# EAGLE design gnax2 (EAGLE 7.3.0)

## Sheet 1 of 3
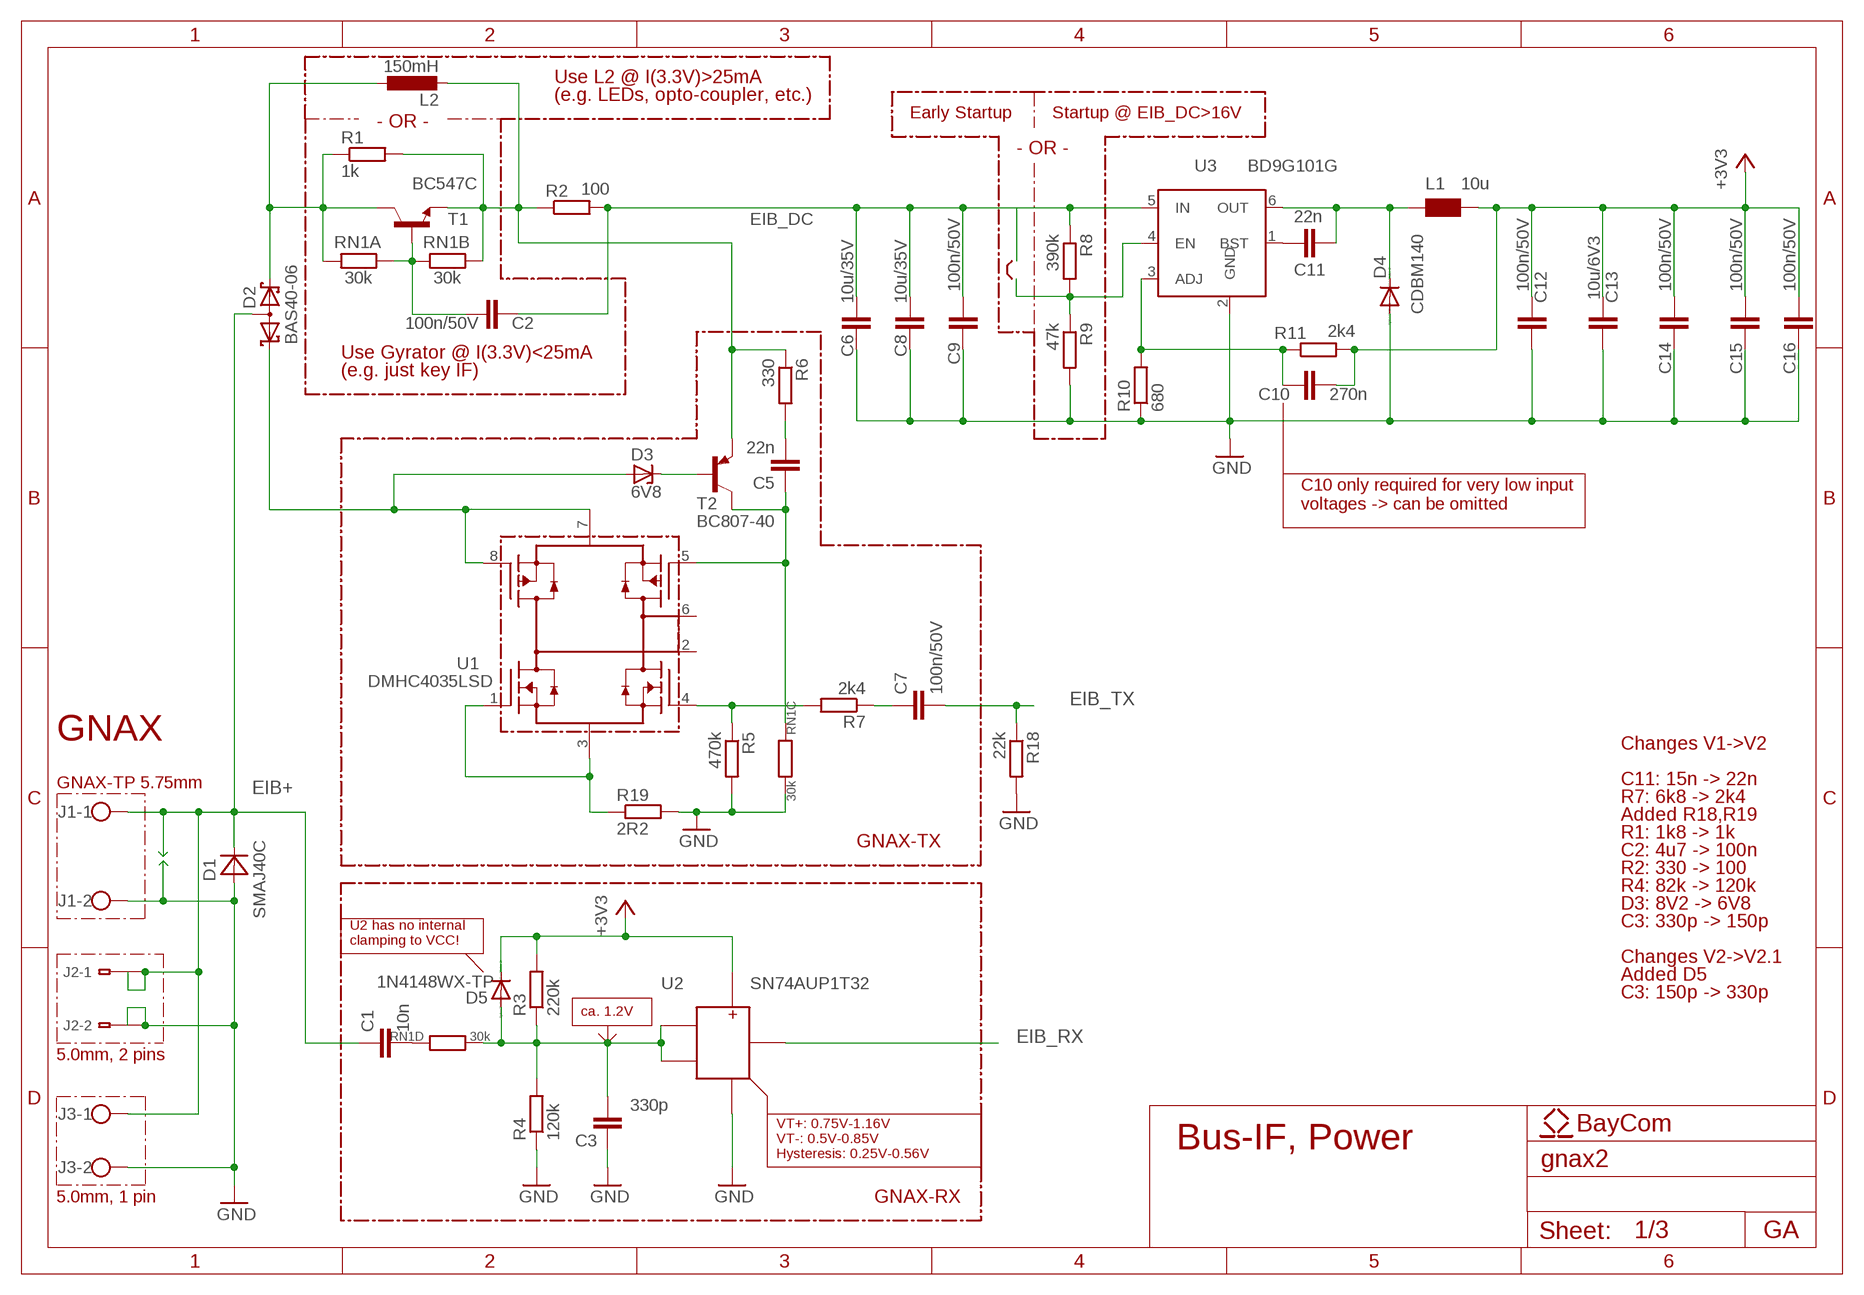
[diagram p0: schematic, sheet 1]

### Parts
C1  10n  C-EUC0603K  [C0603K]
C2  100n/50V  C-EUC0603K  [C0603K]
C3  330p  C-EUC0603K  [C0603K]
C5  22n  C-EUC0603K  [C0603K]
C6  10u/35V  C-EUC1206K  [C1206K]
C7  100n/50V  C-EUC0603K  [C0603K]
C8  10u/35V  C-EUC1206K  [C1206K]
C9  100n/50V  C-EUC0603K  [C0603K]
C10  270n  C-EUC0603K  [C0603K]
C11  22n  C-EUC0603K  [C0603K]
C12  100n/50V  C-EUC0603K  [C0603K]
C13  10u/6V3  C-EUC0603K  [C0603K]
C14  100n/50V  C-EUC0603K  [C0603K]
C15  100n/50V  C-EUC0603K  [C0603K]
C16  100n/50V  C-EUC0603K  [C0603K]
D1  SMAJ40C  MBRA340T3  [SMA]
D2  BAS40-06  [SOT23]
D3  6V8  ZENER-DIODESOT23  [SOT23]
D4  CDBM140  DIODE-SOD123  [SOD123]
D5  1N4148WX-TP  DIODE-SOD323-R  [SOD323-R]
J1  CON_2KNX  [KNX2]
J2-1  236-740-5,08  [236-4XX]
J2-2  236-740-5,08  [236-4XX]
J3  CON_2  [W237-102]
L1  10u  L_VARELL3  [L_ELL3]
L2  150mH  L-EU0204/5  [0204/5]
R1  1k  R-EU_R0603  [R0603]
R2  100  R-EU_R0603  [R0603]
R3  220k  R-EU_R0603  [R0603]
R4  120k  R-EU_R0603  [R0603]
R5  470k  R-EU_R0603  [R0603]
R6  330  R-EU_R0603  [R0603]
R7  2k4  R-EU_R0603  [R0603]
R8  390k  R-EU_R0603  [R0603]
R9  47k  R-EU_R0603  [R0603]
R10  680  R-EU_R0603  [R0603]
R11  2k4  R-EU_R0603  [R0603]
R18  22k  R-EU_R0603  [R0603]
R19  2R2  R-EU_R0805  [R0805]
RN1  30k  RNET12061  [1206_8]
T1  BC547C  BC847  [SOT23]
T2  BC807-40  BC807-40-PNP-SOT23-BEC  [SOT23-BEC]
U1  DMHC4035LSD  DHMC4035LSD  [SOP8]
U2  SN74AUP1T32  74AHC1G32SC88A  [SC88A]
U3  BD9G101G  BD9G101GSOT23-6  [SOT23-6]

### Nets
EIB+: C1.1 D1.C D2.3(AA) J1.1 J2-1.1@1(A1) J2-1.1@2(B1) J3.1 ; also sheet 3
EIB_DC: C2.1 C6.1 C8.1 C9.2 R2.2 R8.1 U3.5(IN) ; also sheet 3
EIB_RX: U2.4(Y) ; also sheet 2
EIB_TX: C7.2 R18.1 ; also sheet 2
FX: R19.1 U1.1(N1G) U1.3(N1S/N2S)
GND: C3.1 C6.2 C8.2 C9.1 C12.1 C13.1 C14.1 C15.1 C16.1 D1.A D4.A J1.2 J2-2.1@2(B1) J3.2 R4.1 R5.2 R9.2 R10.1 R18.2 R19.2 RN1.6 U2.3(GND) U3.2(GND) ; also sheet 2,3
LX: C11.1 D4.C L1.P$1 U3.6(OUT)
N$1: D2.1(K1) D3.1(A) U1.7(P1S/P2S) U1.8(P1G)
N$2: C1.2 RN1.4
N$6: R5.1 R7.2 U1.4(N2G)
N$7: C7.1 R7.1
N$8: D2.2(K2) L2.1 R1.1 RN1.1 T1.3(C)
N$12: C5.1 RN1.3 T2.C U1.5(P2G)
N$14: C3.2 D5.A R3.1 R4.2 RN1.5 U2.1(A) U2.2(B)
N$15: C5.2 R6.2
N$19: C11.2 U3.1(BST)
N$20: R8.2 R9.1 U3.4(EN)
N$24: C10.1 R10.2 R11.1 U3.3(ADJ)
N$28: C2.2 RN1.7 RN1.8 T1.1(B)
N$39: D3.3(C) T2.B
N$46: L2.2 R1.2 R2.1 R6.1 RN1.2 T1.2(E) T2.E
VCC: C10.2 C12.2 C13.2 C14.2 C15.2 C16.2 D5.C L1.P$2 R3.2 R11.2 U2.5(VCC) ; supply symbol labelled +3V3 ; also sheet 2,3
Unconnected: J2-2.1@1(A1) U1.2(P1D/N1D) U1.6(P2D/N2D)

### Notes on the sheet
- Use L2 @ I(3.3V)>25mA
- (e.g. LEDs, opto-coupler, etc.)
- Early Startup | Startup @ EIB_DC>16V
- - OR -
- - OR -
- Use Gyrator @ I(3.3V)<25mA
- (e.g. just key IF)
- C10 only required for very low input
  voltages -> can be omitted
- GNAX
- Changes V1->V2
- GNAX-TP 5.75mm
- C11: 15n -> 22n
- R7: 6k8 -> 2k4
- Added R18,R19
- R1: 1k8 -> 1k
- GNAX-TX
- C2: 4u7 -> 100n
- R2: 330 -> 100
- R4: 82k -> 120k
- D3: 8V2 -> 6V8
- C3: 330p -> 150p
- U2 has no internal 
  clamping to VCC!
- Changes V2->V2.1
- Added D5
- C3: 150p -> 330p
- ca. 1.2V
- 5.0mm, 2 pins
- Bus-IF, Power
- VT+: 0.75V-1.16V
  VT-: 0.5V-0.85V
  Hysteresis: 0.25V-0.56V
- 5.0mm, 1 pin | GNAX-RX
- GA

## Sheet 2 of 3
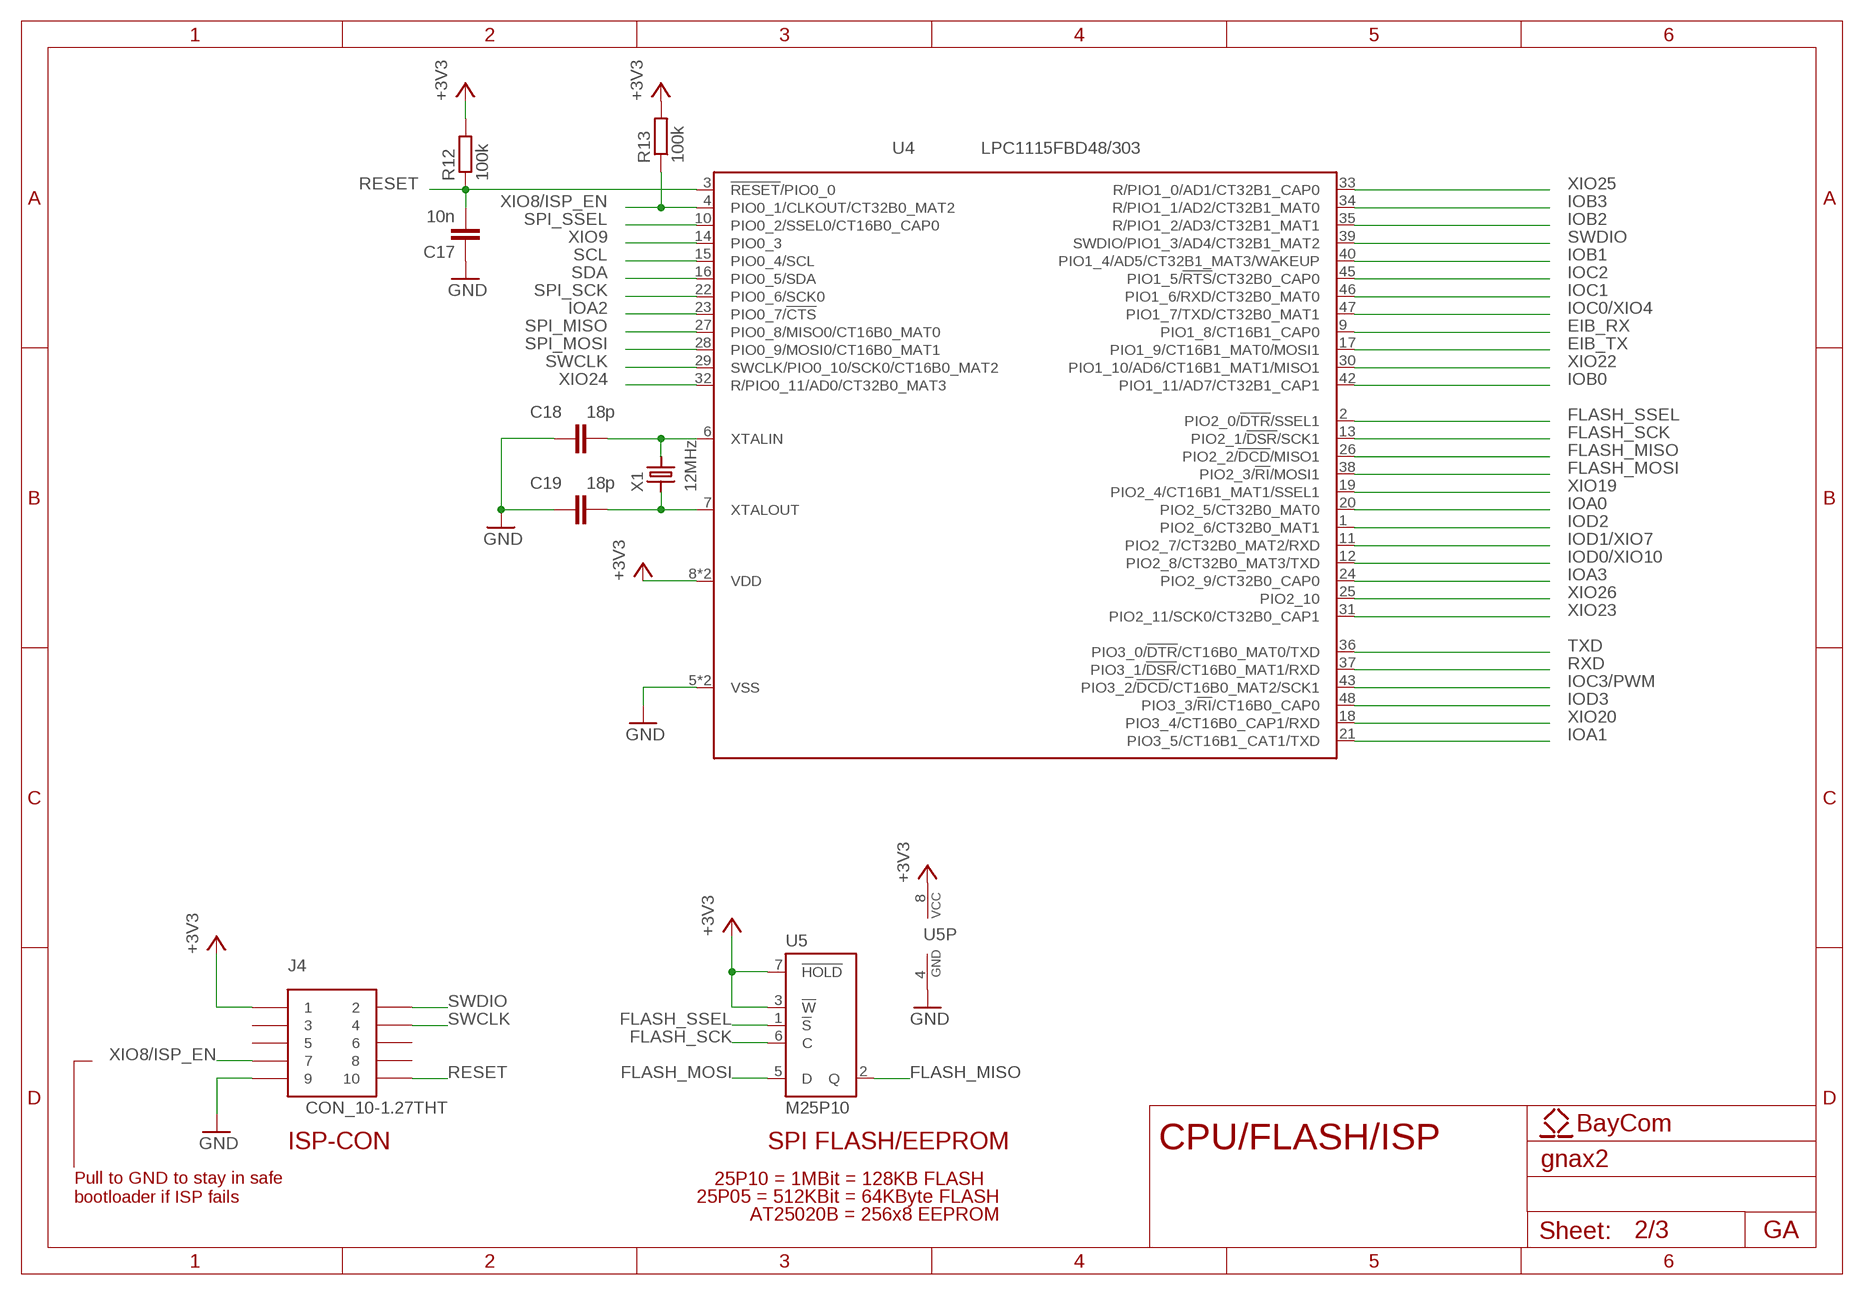
[diagram p1: schematic, sheet 2]

### Parts
C17  10n  C-EUC0603K  [C0603K]
C18  18p  C-EUC0603K  [C0603K]
C19  18p  C-EUC0603K  [C0603K]
J4  CON_10-1.27THT  [CON2X5_127-THT]
R12  100k  R-EU_R0603  [R0603]
R13  100k  R-EU_R0603  [R0603]
U4  LPC1115FBD48/303  [SOT313-2]
U5  M25P10  ST95P08M  [SO08]
X1  12MHz  XTAL5X3.2  [XTAL_5X3.2]

### Nets
EIB_RX: U4.9(PIO1_8/CT16B1_CAP0) ; also sheet 1
EIB_TX: U4.17(PIO1_9/CT16B1_MAT0/MOSI1) ; also sheet 1
FLASH_MISO: U4.26(PIO2_2/!DCD!/MISO1) U5.2(Q)
FLASH_MOSI: U4.38(PIO2_3/!RI!/MOSI1) U5.5(D)
FLASH_SCK: U4.13(PIO2_1/!DSR!/SCK1) U5.6(C)
FLASH_SSEL: U4.2(PIO2_0/!DTR!/SSEL1) U5.1(!S)
GND: C17.1 C18.1 C19.1 J4.9 U4.5(VSS) U4.41(VSS) U5.4(GND) ; also sheet 1,3
IOA0: U4.20(PIO2_5/CT32B0_MAT0) ; also sheet 3
IOA1: U4.21(PIO3_5/CT16B1_CAT1/TXD) ; also sheet 3
IOA2: U4.23(PIO0_7/!CTS!) ; also sheet 3
IOA3: U4.24(PIO2_9/CT32B0_CAP0) ; also sheet 3
IOB0: U4.42(PIO1_11/AD7/CT32B1_CAP1) ; also sheet 3
IOB1: U4.40(PIO1_4/AD5/CT32B1_MAT3/WAKEUP) ; also sheet 3
IOB2: U4.35(R/PIO1_2/AD3/CT32B1_MAT1) ; also sheet 3
IOB3: U4.34(R/PIO1_1/AD2/CT32B1_MAT0) ; also sheet 3
IOC0/XIO4: U4.47(PIO1_7/TXD/CT32B0_MAT1) ; also sheet 3
IOC1: U4.46(PIO1_6/RXD/CT32B0_MAT0) ; also sheet 3
IOC2: U4.45(PIO1_5/!RTS!/CT32B0_CAP0) ; also sheet 3
IOC3/PWM: U4.43(PIO3_2/!DCD!/CT16B0_MAT2/SCK1) ; also sheet 3
IOD0/XIO10: U4.12(PIO2_8/CT32B0_MAT3/TXD) ; also sheet 3
IOD1/XIO7: U4.11(PIO2_7/CT32B0_MAT2/RXD) ; also sheet 3
IOD2: U4.1(PIO2_6/CT32B0_MAT1) ; also sheet 3
IOD3: U4.48(PIO3_3/!RI!/CT16B0_CAP0) ; also sheet 3
N$3: C19.2 U4.7(XTALOUT) X1.1
N$4: C18.2 U4.6(XTALIN) X1.2
RESET: C17.2 J4.10 R12.1 U4.3(!RESET!/PIO0_0)
RXD: U4.37(PIO3_1/!DSR!/CT16B0_MAT1/RXD) ; also sheet 3
SCL: U4.15(PIO0_4/SCL) ; also sheet 3
SDA: U4.16(PIO0_5/SDA) ; also sheet 3
SPI_MISO: U4.27(PIO0_8/MISO0/CT16B0_MAT0) ; also sheet 3
SPI_MOSI: U4.28(PIO0_9/MOSI0/CT16B0_MAT1) ; also sheet 3
SPI_SCK: U4.22(PIO0_6/SCK0) ; also sheet 3
SPI_SSEL: U4.10(PIO0_2/SSEL0/CT16B0_CAP0) ; also sheet 3
SWCLK: J4.4 U4.29(SWCLK/PIO0_10/SCK0/CT16B0_MAT2)
SWDIO: J4.2 U4.39(SWDIO/PIO1_3/AD4/CT32B1_MAT2)
TXD: U4.36(PIO3_0/!DTR!/CT16B0_MAT0/TXD) ; also sheet 3
VCC: J4.1 R12.2 R13.2 U4.8(VDD) U4.44(VDD) U5.3(!W) U5.7(!HOLD) U5.8(VCC) ; supply symbol labelled +3V3 ; also sheet 1,3
XIO8/ISP_EN: J4.7 R13.1 U4.4(PIO0_1/CLKOUT/CT32B0_MAT2) ; also sheet 3
XIO9: U4.14(PIO0_3) ; also sheet 3
XIO19: U4.19(PIO2_4/CT16B1_MAT1/SSEL1) ; also sheet 3
XIO20: U4.18(PIO3_4/CT16B0_CAP1/RXD) ; also sheet 3
XIO22: U4.30(PIO1_10/AD6/CT16B1_MAT1/MISO1) ; also sheet 3
XIO23: U4.31(PIO2_11/SCK0/CT32B0_CAP1) ; also sheet 3
XIO24: U4.32(R/PIO0_11/AD0/CT32B0_MAT3) ; also sheet 3
XIO25: U4.33(R/PIO1_0/AD1/CT32B1_CAP0) ; also sheet 3
XIO26: U4.25(PIO2_10) ; also sheet 3
Unconnected: J4.3 J4.5 J4.6 J4.8

### Notes on the sheet
- ISP-CON | SPI FLASH/EEPROM | CPU/FLASH/ISP
- 25P10 = 1MBit = 128KB FLASH
- Pull to GND to stay in safe
  bootloader if ISP fails
- 25P05 = 512KBit = 64KByte FLASH
- AT25020B = 256x8 EEPROM
- GA

## Sheet 3 of 3
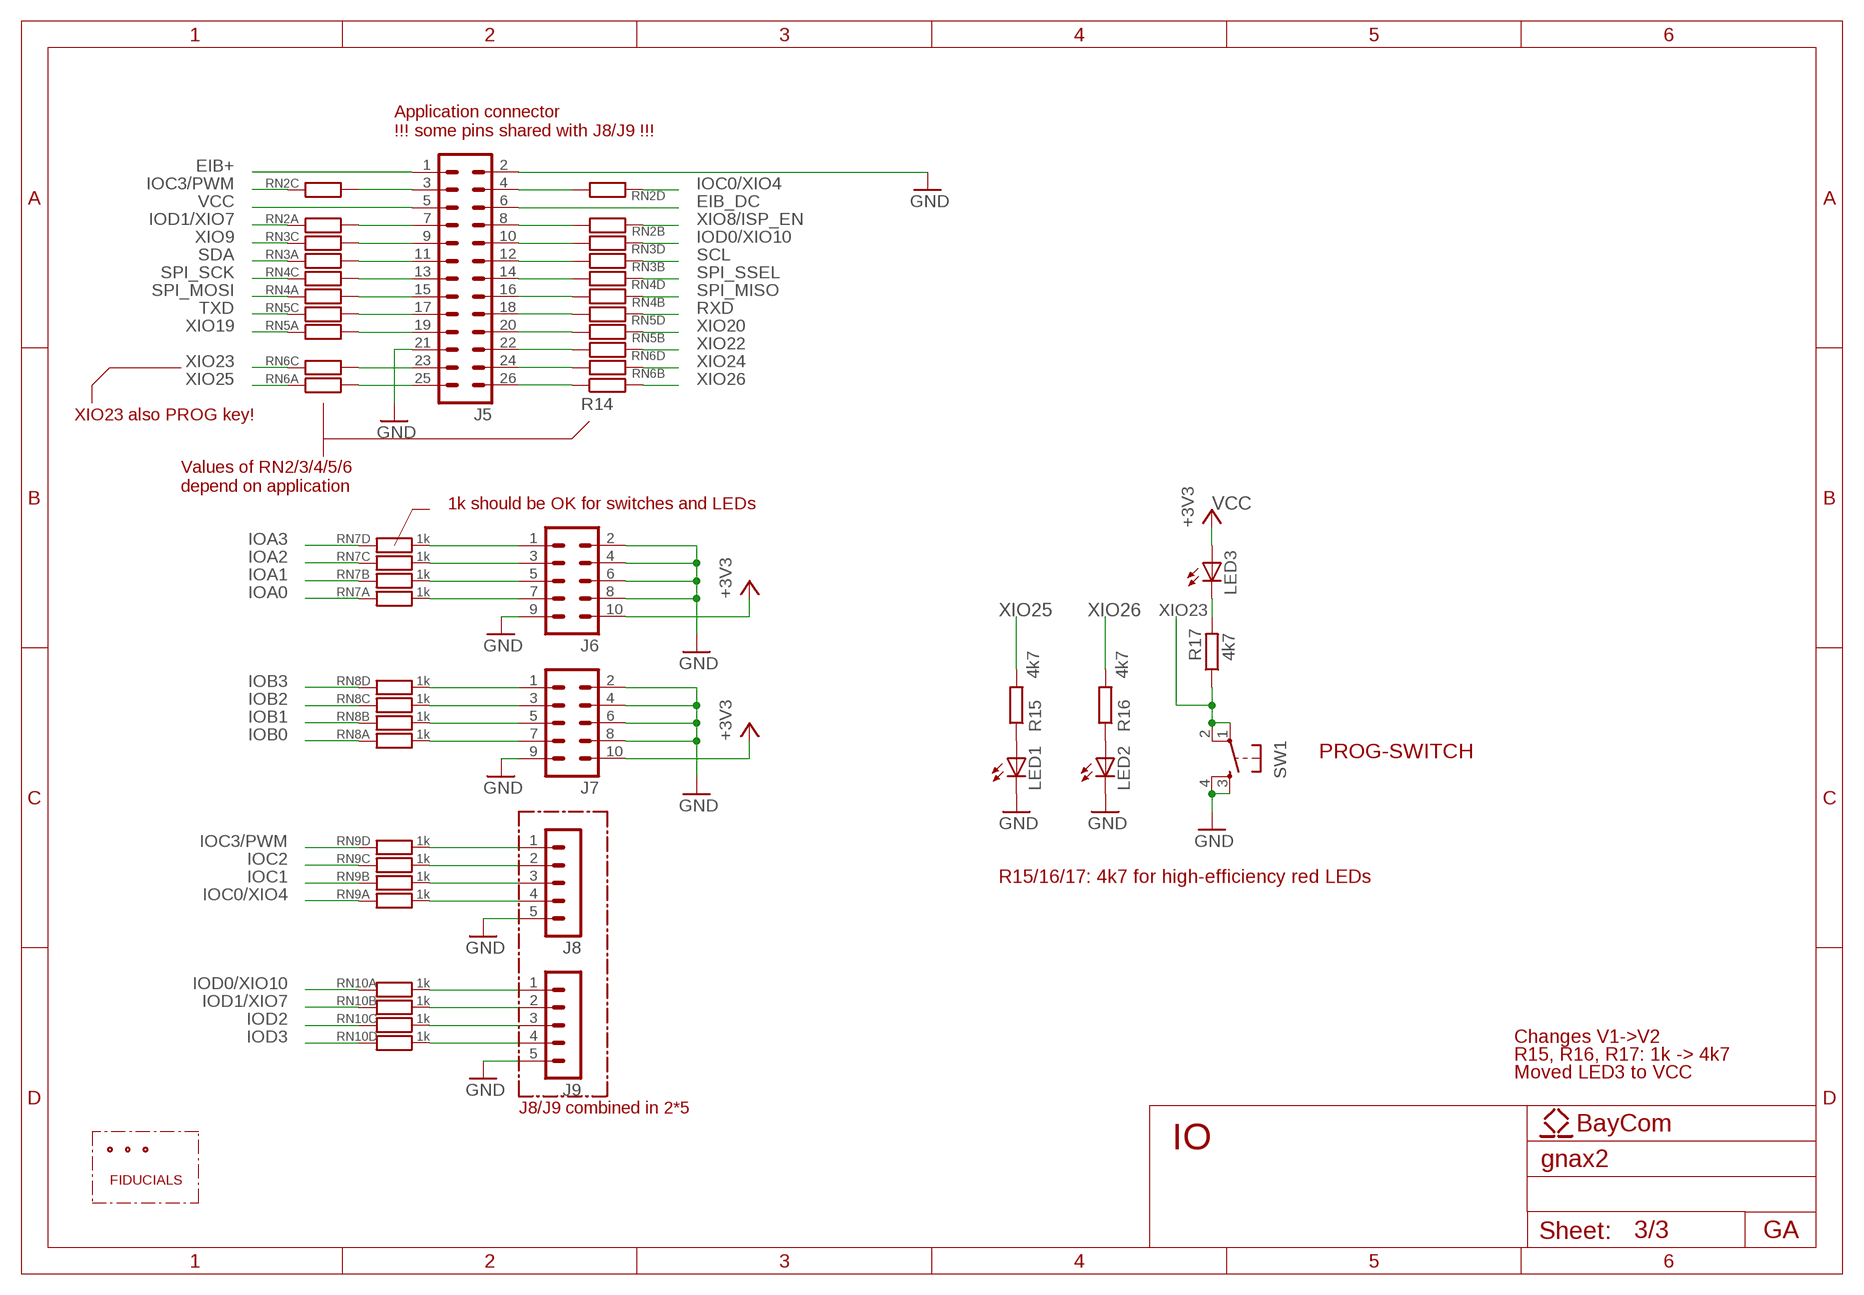
[diagram p2: schematic, sheet 3]

### Parts
J5  MA13-2  [MA13-2]
J6  MA05-2  [MA05-2]
J7  MA05-2  [MA05-2]
J8  MA05-1  [MA05-1]
J9  MA05-1  [MA05-1]
LED1  LEDCHIP-LED0805  [CHIP-LED0805]
LED2  LEDCHIP-LED0805  [CHIP-LED0805]
LED3  LEDCHIP-LED0805  [CHIP-LED0805]
R14  R-EU_R0603  [R0603]
R15  4k7  R-EU_R0603  [R0603]
R16  4k7  R-EU_R0603  [R0603]
R17  4k7  R-EU_R0603  [R0603]
RN2  RNET12061  [1206_8]
RN3  RNET12061  [1206_8]
RN4  RNET12061  [1206_8]
RN5  RNET12061  [1206_8]
RN6  RNET12061  [1206_8]
RN7  1k  RNET12061  [1206_8]
RN8  1k  RNET12061  [1206_8]
RN9  1k  RNET12061  [1206_8]
RN10  1k  RNET12061  [1206_8]
SW1  SWITCH_X  [SWITCH_PTS810]
X3  FIDUCIAL_0.6-1.2MM  [FIDUCIAL0.6-1.2]
X8  FIDUCIAL_0.6-1.2MM  [FIDUCIAL0.6-1.2]
X9  FIDUCIAL_0.6-1.2MM  [FIDUCIAL0.6-1.2]

### Nets
EIB+: J5.1 ; also sheet 1
EIB_DC: J5.6 ; also sheet 1
GND: J5.2 J5.21 J6.2 J6.4 J6.6 J6.8 J6.9 J7.2 J7.4 J7.6 J7.8 J7.9 J8.5 J9.5 LED1.C LED2.C SW1.3(S) SW1.4(S1) ; also sheet 1,2
IOA0: RN7.1 ; also sheet 2
IOA1: RN7.2 ; also sheet 2
IOA2: RN7.3 ; also sheet 2
IOA3: RN7.4 ; also sheet 2
IOB0: RN8.1 ; also sheet 2
IOB1: RN8.2 ; also sheet 2
IOB2: RN8.3 ; also sheet 2
IOB3: RN8.4 ; also sheet 2
IOC0/XIO4: RN2.4 RN9.1 ; also sheet 2
IOC1: RN9.2 ; also sheet 2
IOC2: RN9.3 ; also sheet 2
IOC3/PWM: RN2.3 RN9.4 ; also sheet 2
IOD0/XIO10: RN3.4 RN10.1 ; also sheet 2
IOD1/XIO7: RN2.1 RN10.2 ; also sheet 2
IOD2: RN10.3 ; also sheet 2
IOD3: RN10.4 ; also sheet 2
N$5: J6.7 RN7.8
N$9: LED1.A R15.1
N$10: J6.5 RN7.7
N$11: J6.3 RN7.6
N$13: J6.1 RN7.5
N$16: J7.5 RN8.7
N$17: J7.3 RN8.6
N$22: J7.7 RN8.8
N$23: J7.1 RN8.5
N$25: LED3.C R17.2
N$29: J8.3 RN9.7
N$30: J8.2 RN9.6
N$31: J8.4 RN9.8
N$32: J9.1 RN10.8
N$33: J9.2 RN10.7
N$34: J9.3 RN10.6
N$35: J9.4 RN10.5
N$36: J8.1 RN9.5
N$37: LED2.A R16.1
N$38: J5.3 RN2.6
N$41: J5.7 RN2.8
N$42: J5.9 RN3.6
N$43: J5.11 RN3.8
N$44: J5.13 RN4.6
N$45: J5.4 RN2.5
N$47: J5.8 RN2.7
N$48: J5.10 RN3.5
N$49: J5.12 RN3.7
N$50: J5.14 RN4.5
N$58: J5.15 RN4.8
N$59: J5.17 RN5.6
N$60: J5.16 RN4.7
N$61: J5.18 RN5.5
N$63: J5.19 RN5.8
N$64: J5.20 RN5.7
N$65: J5.22 RN6.5
N$66: J5.23 RN6.6
N$67: J5.24 RN6.7
N$68: J5.25 RN6.8
N$69: J5.26 R14.1
RXD: RN5.4 ; also sheet 2
SCL: RN3.2 ; also sheet 2
SDA: RN3.1 ; also sheet 2
SPI_MISO: RN4.2 ; also sheet 2
SPI_MOSI: RN4.1 ; also sheet 2
SPI_SCK: RN4.3 ; also sheet 2
SPI_SSEL: RN4.4 ; also sheet 2
TXD: RN5.3 ; also sheet 2
VCC: J5.5 J6.10 J7.10 LED3.A ; supply symbol labelled +3V3 ; also sheet 1,2
XIO8/ISP_EN: RN2.2 ; also sheet 2
XIO9: RN3.3 ; also sheet 2
XIO19: RN5.1 ; also sheet 2
XIO20: RN5.2 ; also sheet 2
XIO22: RN6.4 ; also sheet 2
XIO23: R17.1 RN6.3 SW1.1(P) SW1.2(P1) ; also sheet 2
XIO24: RN6.2 ; also sheet 2
XIO25: R15.2 RN6.1 ; also sheet 2
XIO26: R14.2 R16.2 ; also sheet 2

### Notes on the sheet
- Application connector
  !!! some pins shared with J8/J9 !!!
- XIO23 also PROG key!
- Values of RN2/3/4/5/6
  depend on application
- 1k should be OK for switches and LEDs
- PROG-SWITCH
- R15/16/17: 4k7 for high-efficiency red LEDs
- Changes V1->V2
- R15, R16, R17: 1k -> 4k7
- Moved LED3 to VCC
- J8/J9 combined in 2*5
- IO
- FIDUCIALS
- GA

## Library data of the parts
C1-C3 C5-C19 = rcl:C-EU: CAPACITOR, European symbol
D1 = diode:MBRA340T3: Surface Mount Schottky Power Rectifier Source: http://www.onsemi.com/pub_link/Collateral/MBRA340T3-D.PDF
D2 = diode:BAS40-06: Silicon Schottky Diodes General-purpose diode for high-speed switching
D3 = diode:ZENER-DIODE: Z-Diode
D4 D5 = diode:DIODE-: DIODE
J1 = 000_ga:CON_2: WAGO SCREW CLAMP KNX = Wago 243-211
J2-1 J2-2 = con-wago:236: Anreihbare Einzelklemme 2,5 mm² 16A Rastermaß 5/5,08 | 7,5/7,62 | 10/10,16
J3 = 000_ga:CON_2: WAGO SCREW CLAMP KNX = Wago 243-211; MPN: 237-102; OC_FARNELL: unknown; OC_NEWARK: 70K9898
J4 = 000_ga:CON_10
J5 = con-lstb:MA13-2: PIN HEADER; OC_FARNELL: unknown; OC_NEWARK: unknown
J6 J7 = con-lstb:MA05-2: PIN HEADER; OC_FARNELL: unknown; OC_NEWARK: unknown
J8 J9 = con-lstb:MA05-1: PIN HEADER; OC_FARNELL: unknown; OC_NEWARK: unknown
L1 = 000_ga:L_VAR
L2 = rcl:L-EU: INDUCTOR, European symbol
LED1-LED3 = led:LED: LED OSRAM: - CHIPLED LG R971, LG N971, LY N971, LG Q971, LY Q971, LO R971, LY R971 LH N974, LH R974 LS Q976, LO Q976, LY Q976 LO Q996 - Hyper CHIPLED LW Q18S LB Q993, LB Q99A, LB R99A - SideLED LS A670, LO A670, LY A670, LG A670, LP A670 LB A673, LV A673, LT A673, LW A673 LH A674 LY A675 LS A676, LA A676, LO A676, LY A676, LW A676 LS A679, LY A679, LG A679 - Hyper Micro SIDELED® LS Y876, LA Y876, LO Y876, LY Y876 LT Y87S - SmartLED LW L88C, LW L88S LB L89C, LB L89S, LG L890 LS L89K, LO L89K, LY L89K LS L896, LA L896, LO L896, LY L896 - TOPLED LS T670, LO T670, LY T670, LG T670, LP T670 LSG T670, LSP T670, LSY T670, LOP T670, LYG T670 LG T671, LOG T671, LSG T671 LB T673, LV T673, LT T673, LW T673 LH T674 LS T676, LA T676, LO T676, LY T676, LB T676, LH T676, LSB T676, LW T676 LB T67C, LV T67C, LT T67C, LS T67K, LO T67K, LY T67K, LW E67C LS E67B, LA E67B, LO E67B, LY E67B, LB E67C, LV E67C, LT E67C LW T67C LS T679, LY T679, LG T679 LS T770, LO T770, LY T770, LG T770, LP T770 LB T773, LV T773, LT T773, LW T773 LH T774 LS E675, LA E675, LY E675, LS T675 LS T776, LA T776, LO T776, LY T776, LB T776 LHGB T686 LT T68C, LB T68C - Hyper Mini TOPLED® LB M676 - Mini TOPLED Santana® LG M470 LS M47K, LO M47K, LY M47K Source: http://www.osram.convergy.de LUXEON: - LUMILED® LXK2-PW12-R00, LXK2-PW12-S00, LXK2-PW14-U00, LXK2-PW14-V00 LXK2-PM12-R00, LXK2-PM12-S00, LXK2-PM14-U00 LXK2-PE12-Q00, LXK2-PE12-R00, LXK2-PE12-S00, LXK2-PE14-T00, LXK2-PE14-U00 LXK2-PB12-K00, LXK2-PB12-L00, LXK2-PB12-M00, LXK2-PB14-N00, LXK2-PB14-P00, LXK2-PB14-Q00 LXK2-PR12-L00, LXK2-PR12-M00, LXK2-PR14-Q00, LXK2-PR14-R00 LXK2-PD12-Q00, LXK2-PD12-R00, LXK2-PD12-S00 LXK2-PH12-R00, LXK2-PH12-S00 LXK2-PL12-P00, LXK2-PL12-Q00, LXK2-PL12-R00 Source: www.luxeon.com KINGBRIGHT: KA-3528ASYC Source: www.kingbright.com
R1-R19 = rcl:R-EU_: RESISTOR, European symbol
RN1-RN10 = 000_ga:RNET1206
SW1 = 000_ga:SWITCH_X
T1 = transistor:BC847: NPN TRANSISTOR
T2 = transistor:*-PNP-: PNP Transistror
U1 = 000_ga:DHMC4035LSD
U2 = 000_ga:74AHC1G32: SC88A=SC70-5
U3 = 000_ga:BD9G101G
U4 = nxp_60_1_1:LPC1115FBD48/303: 32-bit ARM Cortex-M0 microcontroller; up to 64 kB flash and 8 kB SRAM The LPC1110/11/12/13/14/15 are a ARM Cortex-M0 based, low-cost 32-bit MCU family, designed for 8/16-bit microcontroller applications, offering performance, low power, simple instruction set and memory addressing together with reduced code size compared to existing 8/16-bit architectures. The LPC1110/11/12/13/14/15 operate at CPU frequencies of up to 50 MHz. The peripheral complement of the LPC1110/11/12/13/14/15 includes up to 64 kB of flash memory, up to 8 kB of data memory, one Fast-mode Plus I 2 C-bus interface, one RS-485/EIA-485 UART, up to two SPI interfaces with SSP features, four general purpose counter/timers, a 10-bit ADC, and up to 42 general purpose I/O pins. Remark: The LPC111x series consists of the LPC1100 series (parts LPC111x/101/201/301), LPC1100L series (parts LPC111x/002/102/202/302), and the LPC1100XL series (parts LPC111x/103/203/303/323/333). The LPC1100L and LPC1100XL series include the power profiles, a windowed watchdog timer, and a configurable open-drain mode. AAL Eindhoven MK; ADC: 8; FLASH: 64kB; GPIO: 42; PWR_PROFILES: yes; SERIES: LPC1100XL; SPI: 2; SRAM: 8kB
U5 = st-microelectronics:ST95P08M: Serial EEPROM SPI bus, 1 K x 8; OC_FARNELL: unknown; OC_NEWARK: unknown
X1 = 000_ga:XTAL
X3 X8 X9 = nxp_60_1_1:FIDUCIAL_0.6-1.2MM

## Board
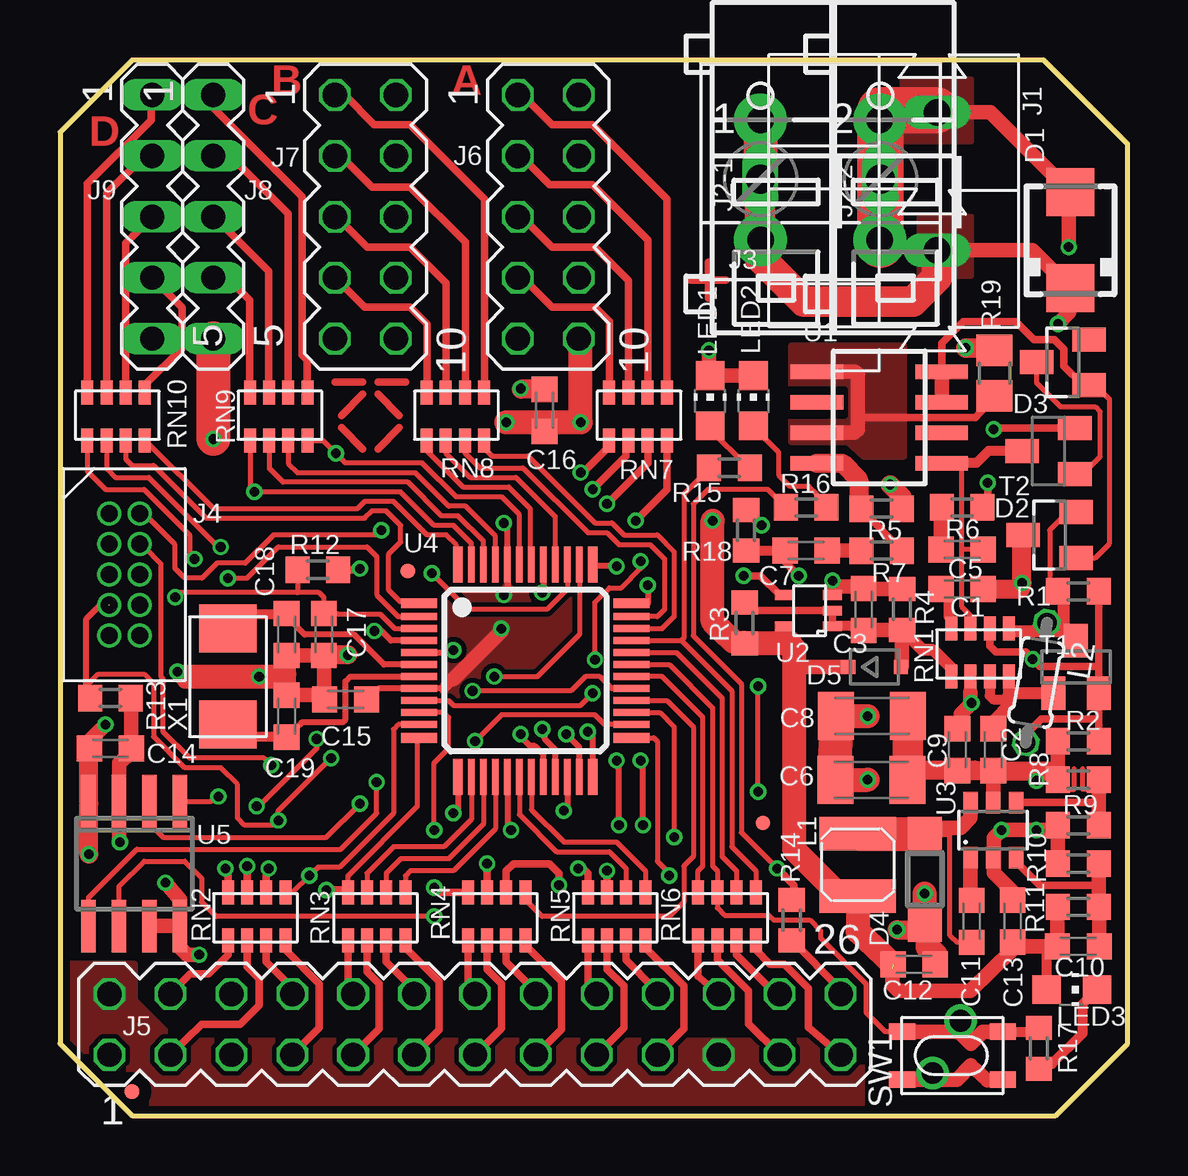
[diagram p3: board, top side]
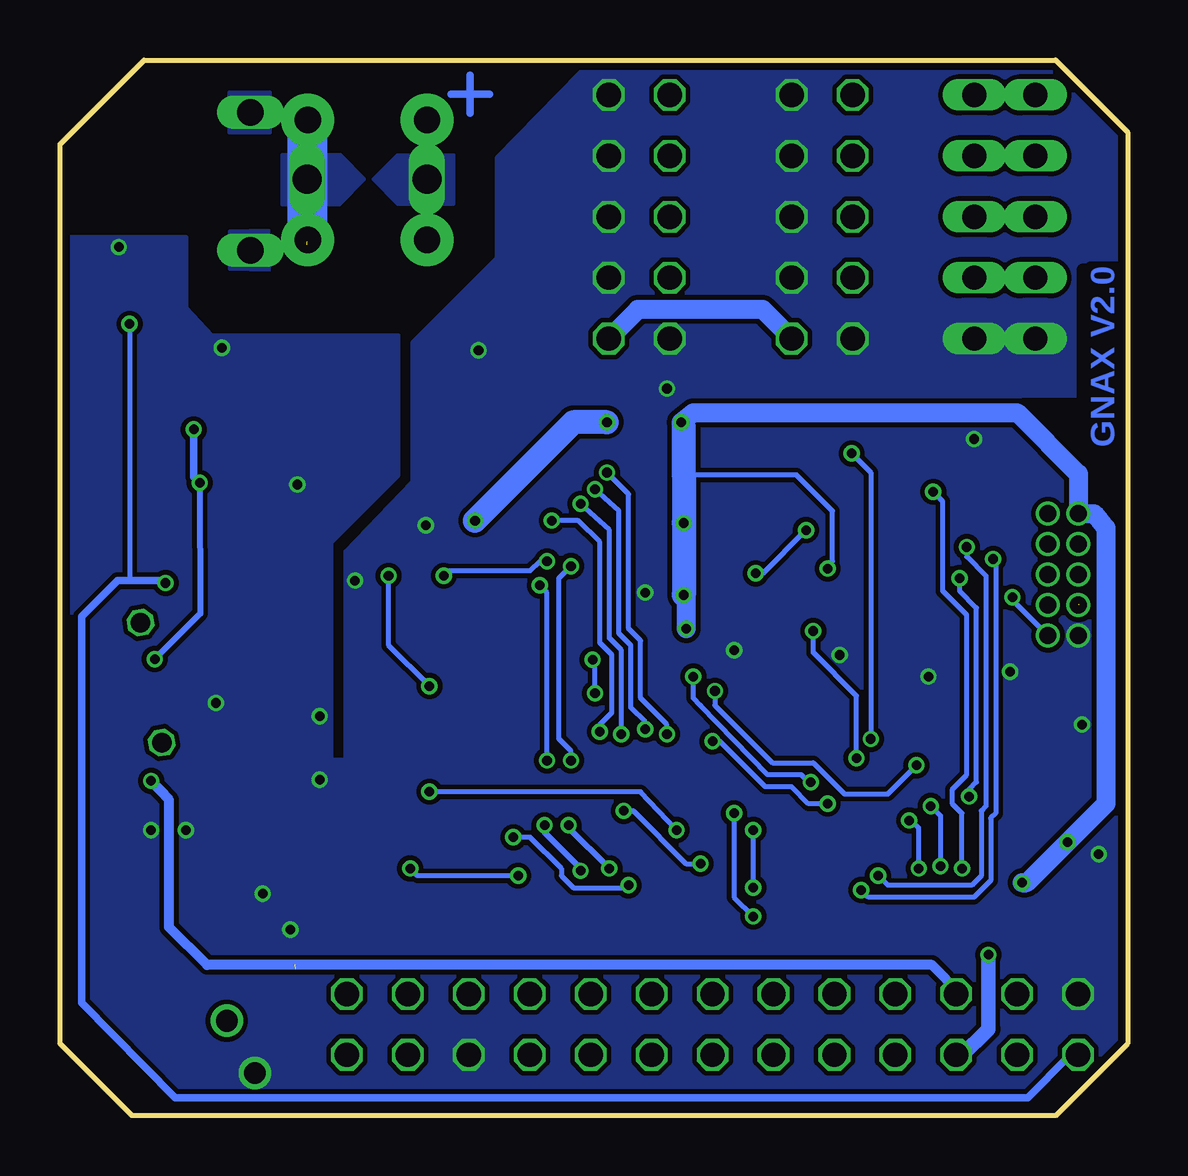
[diagram p4: board, bottom side, seen from below]

Size 44.5 x 44 mm. Coordinates in mm from the lower left corner, seen from the top.
Outline: 3,0 41.5,0 44.5,3 44.5,40.5 41,44 3,44 0,41 0,3 3,0
Copper layers (1*2*15*16): Top 0.035mm / dielectric 0.5mm / Route2 0.035mm / dielectric 0.5mm / Route15 0.035mm / dielectric 0.5mm / Bottom 0.035mm
Design rules "mvpcb15 *": minimum track width 0.14mm, minimum drill 0.3mm, track to track 0.15mm, track to pad 0.15mm, pad to pad 0.15mm, via to via 0.15mm, smd to smd 0.15mm, copper to edge 12mil, drill to drill 6mil, minimum pad ring 0.15mm, minimum via ring 0.14mm, stop-mask expansion 0mil, vias tented up to drill 0.5mm, thermal gap 10mil
tRestrict: 3 lines
bRestrict: 3 lines

### Footprints (pad centres in the part's own frame; a part is rotated, then mirrored left to right if it is on the bottom)
C0603K = smd 1.05 x 1.08: 1 -0.875,0; 2 0.875,0
C1206K = smd 1.5 x 2: 1 -1.5,0; 2 1.5,0
SMA = smd 2 x 2: A 2,0; C -2,0
SOT23 = smd 1 x 1.4: 1 -0.95,-1.1; 2 0.95,-1.1; 3 0,1.1
SOD123 = smd 1.4 x 1.4: A 1.9,0; C -1.9,0
SOD323-R = smd 0.6 x 0.6: A 1.1,0; C -1.1,0
KNX2 = drill 1.1 long: 1 -2.5,0; 2 3.25,0
236-4XX = drill 1.1 pad 2.2: 1@1 0,-2.5; 1@2 0,2.5
W237-102 = drill 1.194 long: 1 -2.5,-1.27; 2 2.5,-1.27
CON2X5_127-THT = drill 0.7 pad 1: 1 -2.54,0; 2 -2.54,1.27; 3 -1.27,0; 4 -1.27,1.27; 5 0,0; 6 0,1.27; 7 1.27,0; 8 1.27,1.27; 9 2.54,0; 10 2.54,1.27
MA13-2 = drill 1.016 octagon: 1 -15.24,-1.27; 2 -15.24,1.27; 3 -12.7,-1.27; 4 -12.7,1.27; 5 -10.16,-1.27; 6 -10.16,1.27; 7 -7.62,-1.27; 8 -7.62,1.27; 9 -5.08,-1.27; 10 -5.08,1.27; 11 -2.54,-1.27; 12 -2.54,1.27; 13 0,-1.27; 14 0,1.27; 15 2.54,-1.27; 16 2.54,1.27; 17 5.08,-1.27; 18 5.08,1.27; 19 7.62,-1.27; 20 7.62,1.27; 21 10.16,-1.27; 22 10.16,1.27; 23 12.7,-1.27; 24 12.7,1.27; 25 15.24,-1.27; 26 15.24,1.27
MA05-2 = drill 1.016 octagon: 1 -5.08,-1.27; 2 -5.08,1.27; 3 -2.54,-1.27; 4 -2.54,1.27; 5 0,-1.27; 6 0,1.27; 7 2.54,-1.27; 8 2.54,1.27; 9 5.08,-1.27; 10 5.08,1.27
MA05-1 = drill 1.016 long: 1 -5.08,0; 2 -2.54,0; 3 0,0; 4 2.54,0; 5 5.08,0
L_ELL3 = smd 1.4 x 3.2: P$1 -1.3,0; P$2 1.3,0
0204/5 = drill 0.813 octagon: 1 -2.54,0; 2 2.54,0
CHIP-LED0805 = smd 1.2 x 1.2: A 0,-1.05; C 0,1.05
R0603 = smd 1 x 1.1: 1 -0.85,0; 2 0.85,0
R0805 = smd 1.3 x 1.5: 1 -0.95,0; 2 0.95,0
1206_8 = smd 1 x 0.5: 1 0.2,0; 2 0.2,-0.8; 3 0.2,-1.6; 4 0.2,-2.4; 5 2.2,-2.4; 6 2.2,-1.6; 7 2.2,-0.8; 8 2.2,0
SWITCH_PTS810 = smd 1.1 x 0.7: 1 -2.1,1; 2 2.1,1; 3 -2.1,-1; 4 2.1,-1
SOT23-BEC = smd 1 x 1.4: B -0.95,-1.1; C 0,1.1; E 0.95,-1.1
SOP8 = smd 0.6 x 2.2: 1 -1.905,-2.6; 2 -0.635,-2.6; 3 0.635,-2.6; 4 1.905,-2.6; 5 1.905,2.6; 6 0.635,2.6; 7 -0.635,2.6; 8 -1.905,2.6
SC88A = smd 0.4 x 0.8: 1 0,0; 2 0.65,0; 3 1.3,0; 4 1.3,2; 5 0,2
SOT23-6 = smd 0.6 x 0.9: 1 -0.95,-1.15; 2 0,-1.15; 3 0.95,-1.15; 4 0.95,1.15; 5 0,1.15; 6 -0.95,1.15
SOT313-2 = smd 0.4 x 1.5: 1 -2.81,-4.425; 12 2.81,-4.425; 25 2.81,4.425; 36 -2.81,4.425 | smd 0.28 x 1.5: 2 -2.25,-4.425; 3 -1.75,-4.425; 4 -1.25,-4.425; 5 -0.75,-4.425; 6 -0.25,-4.425; 7 0.25,-4.425; 8 0.75,-4.425; 9 1.25,-4.425; 10 1.75,-4.425; 11 2.25,-4.425; 26 2.25,4.425; 27 1.75,4.425; 28 1.25,4.425; 29 0.75,4.425; 30 0.25,4.425; 31 -0.25,4.425; 32 -0.75,4.425; 33 -1.25,4.425; 34 -1.75,4.425; 35 -2.25,4.425 | smd 1.5 x 0.4: 13 4.425,-2.81; 24 4.425,2.81; 37 -4.425,2.81; 48 -4.425,-2.81 | smd 1.5 x 0.28: 14 4.425,-2.25; 15 4.425,-1.75; 16 4.425,-1.25; 17 4.425,-0.75; 18 4.425,-0.25; 19 4.425,0.25; 20 4.425,0.75; 21 4.425,1.25; 22 4.425,1.75; 23 4.425,2.25; 38 -4.425,2.25; 39 -4.425,1.75; 40 -4.425,1.25; 41 -4.425,0.75; 42 -4.425,0.25; 43 -4.425,-0.25; 44 -4.425,-0.75; 45 -4.425,-1.25; 46 -4.425,-1.75; 47 -4.425,-2.25
SO08 = smd 0.6 x 2.2: 1 -1.905,-2.6; 2 -0.635,-2.6; 3 0.635,-2.6; 4 1.905,-2.6; 5 1.905,2.6; 6 0.635,2.6; 7 -0.635,2.6; 8 -1.905,2.6
XTAL_5X3.2 = smd 2 x 2.4: 1 -2,0; 2 2,0
FIDUCIAL0.6-1.2 = smd 0.6 x 0.6: 1 0,0

### Placement (x,y rotation side)
C1  37.6,21.95 180 top
C2  38.9,15.25 90 top
C3  33.5,21.1 270 top
C5  37.6,23.6 180 top
C6  33.83,14 180 top
C7  31.1,23.55 180 top
C8  33.85,16.65 180 top
C9  37.4,15.25 270 top
C10  42.45,7.05 180 top
C11  38,8.1 90 top
C12  35.6,6.3 180 top
C13  39.71,8.11 270 top
C14  2.1,15.3 0 top
C15  11.9,17.35 0 top
C16  20.2,29.4 270 top
C17  11,20.05 90 top
C18  9.45,20.05 90 top
C19  9.45,16.65 270 top
D1  42.12,36.48 90 top
D2  41.25,24.2 90 top
D3  41.8,31.4 90 top
D4  36.05,9.85 270 top
D5  33.95,18.7 0 top
J1  36.56,38.57 90 top
J2-1  29.2,39 0 top
J2-2  34.17,39 0 top
J3  31.7,40.3 0 top
J4  2.05,22.55 270 top
J5  17.3,3.8 0 top
J6  20.36,37.47 270 top
J7  12.73,37.47 270 top
J8  6.38,37.47 270 top
J9  3.85,37.47 270 top
L1  33.25,10.45 270 top
L2  40.7,18.05 260 top
LED1  27.1,29.8 0 top
LED2  28.9,29.8 0 top
LED3  42.17,5.25 270 top
R1  42.45,21.85 0 top
R2  42.45,15.6 180 top
R3  28.54,20.53 270 top
R4  35.1,21.1 270 top
R5  34.25,25.3 0 top
R6  37.6,25.35 180 top
R7  34.25,23.55 0 top
R8  42.45,14 0 top
R9  42.45,12.1 180 top
R10  42.45,10.5 0 top
R11  42.45,8.7 180 top
R12  10.75,22.75 0 top
R13  2.1,17.4 0 top
R14  30.5,8.15 90 top
R15  27.9,27 180 top
R16  31.1,25.35 180 top
R17  40.8,2.8 270 top
R18  28.6,24.4 90 top
R19  38.95,30.95 90 top
RN1  39.55,20.5 270 top
RN2  9.4,9.5 270 top
RN3  14.4,9.5 270 top
RN4  19.4,9.5 270 top
RN5  24.4,9.5 270 top
RN6  29,9.5 270 top
RN7  22.89,27.94 90 top
RN8  15.28,27.94 90 top
RN9  7.92,27.94 90 top
RN10  1.14,27.94 90 top
SW1  37.2,2.5 0 top
T1  42.35,18.7 0 top
T2  41.2,27.7 90 top
U1  34.15,29.1 270 top
U2  32.2,20.4 90 top
U3  38.9,11.9 0 top
U4  19.4,18.55 270 top
U5  3.1,10.5 180 top
U$1  [BAYCOM_LOGO]  13,29 180 top
X1  7,18.3 90 top
X3  14.5,22.7 0 top
X8  29.3,12.2 0 top
X9  3,1 0 top

### Tracks (layer width: path | path; a pad name or v marks a point on that pad's centre or on a via)
DUMMY
  Bottom 0.305: 26.6,42.58 27.4,42.58 | 27.4,42.58 28.2,42.58 | 27.4,43.38 27.4,42.58 | 27.4,42.58 27.4,41.77
DUMMY1
  Top 0.305: 26.27,34.83 27.02,34.83 | 27.02,34.83 27.75,34.83 | 27.02,34.08 27.02,34.83 | 27.02,34.83 27.02,35.58
EIB+  (via drill 0.4)
  Top 0.2: 40.15,23.98 D2.3 40.1,24.15
  Top 0.305: D1.C 42.08,33.48
  Top 0.6: 40.05,21.95 v40.1,22.2 | J1.1 40.53,36.07 D1.C
  Top 0.61: 42.08,33.48 v41.6,33
  Top 0.8: v40.1,22.2 40.1,24.15 | C1.1 40.05,21.95
  Top 1.27: J1.1 36.56,34.94 35.55,33.92 31,33.92 29.15,35.77 29.18,36.3 | 29.18,36.3 29.18,39.01 J3.1 | J2-1.1@1 29.2,36.27 29.18,36.3
  Top 1.422: J2-1.1@2 J3.1
  Bottom 0.2: v41.6,33 41.6,22.3 | 40.2,22.3 v40.1,22.2
  Bottom 0.305: J5.1 2.46,2.44 4.15,0.75 39.7,0.75 43.6,4.7 43.6,20.8 42.1,22.3 41.6,22.3 40.2,22.3
  pour Bottom (no thermals): 35.77,35.25 35.8,36.9 37.42,36.88 37.42,35.27
  pour Top (no thermals): 35.8,34.98 38,35 38,37.5 35.8,37.48
  pour Bottom (no thermals): 28.1,40.05 30.45,40.02 31.45,39.02 30.4,37.98 28.1,38
EIB_DC  (via drill 0.4)
  Top 0.2: 41.6,14.35 R8.1 42,13.6 42.27,13.6 42.27,14.45 | v40.7,13.95 41.4,14.38
  Top 0.406: 41.38,14.22 41.6,14.35 | 38.97,14.3 C2.1
  Top 0.6: 41.6,14.35 R2.2 | C6.1 35.35,14.55 | 38.12,14.4 C9.2 | U3.5 38.9,14.23 38.97,14.3
  Top 0.8: 41.38,14.22 41.4,14.38 C2.1 C9.2 | 35.35,14.55 35.5,14.4 38.12,14.4 38.15,14.4
  Top 1.27: 35.35,14.55 C8.1
  Bottom 0.2: J5.6 6.94,5.06
  Bottom 0.406: 6.94,5.06 8.15,6.28 38.38,6.28 39.95,7.85 39.95,13.15 v40.7,13.95
EIB_RX  (via drill 0.4)
  Top 0.2: U4.9 16.2,17.3 16.4,17.1 21.7,17.1 v22.2,17.6 | v22.3,19 22.3,21.4 22.9,22 23.4,22 24.2,22.8 v24.2,23.1
  Top 0.305: v28.5,22.5 29.2,22.5 30,21.7 U2.4
  Bottom 0.2: v22.2,17.6 22.2,18.8 v22.3,19 | v24.2,23.1 24.5,23.1 24.9,22.7 28.25,22.7 28.45,22.5 v28.5,22.5
EIB_TX  (via drill 0.4)
  Top 0.2: v29.1,13.5 v29.1,17.9 | 30,23.57 C7.2
  Top 0.254: U4.17 18.65,12.05 v18.8,11.9
  Top 0.305: v30.8,22.5 30,23.3 30,23.57
  Top 0.406: R18.1 C7.2
  Bottom 0.2: v18.8,11.9 20.3,13.5 v29.1,13.5 | v29.1,17.9 30.8,19.6 v30.8,22.5
FLASH_MISO  (via drill 0.4)
  Top 0.2: U4.26 22.7,16.3 22.3,16.7 18.4,16.7 v17.3,15.6 | U5.2 3.73,12.16 4.3,11.6 11.1,11.6 v12.5,13
  Bottom 0.2: v12.5,13 13.3,13 14,13.7 15.1,13.7 17,15.6 v17.3,15.6
FLASH_MOSI  (via drill 0.4)
  Top 0.2: U4.38 21.65,20.05 19.9,18.3 v18.1,18.3 | U5.5 1.2,9.1 3.2,11.1 11.7,11.1 13.2,12.6 v13.2,13.9
  Bottom 0.2: v13.2,13.9 13.3,13.9 13.6,14.2 15,14.2 17.8,17.1 18.1,17.4 v18.1,18.3
FLASH_SCK  (via drill 0.4)
  Top 0.2: U4.13 16.59,13.99 | v15.6,8.3 6.5,8.3 5.9,8.9 5.9,9.9 5.2,10.6 3.5,10.6 2.46,9.56 U5.6
  Top 0.254: 16.59,13.99 16.6,13.3 16.6,12.8 v16.4,12.6
  Bottom 0.2: v16.4,12.6 16.4,9.1 v15.6,8.3
FLASH_SSEL  (via drill 0.4)
  Top 0.2: U5.1 6.3,13.1 v6.6,13.3 | v7,22.4 7.8,22.4 9.1,23.7 12.8,23.7 13.2,23.3 13.2,21.7 14.1,20.8 U4.2
  Bottom 0.2: v6.6,13.3 6.6,13.6 6.3,13.9 6.3,21.16 7,21.86 v7,22.4
FX
  Top 0.2: R19.1 38.85,29.85
  Top 0.305: 38.85,29.85 38.15,29.1 33.25,29.1
  Top 0.61: U1.1 33.15,31 33.25,30.9 33.25,29.1 33.25,28.6 33.12,28.46 U1.3
  pour Top (no thermals): 30.5,28.1 30.5,32.08 35.15,32.08 35.15,27.5 33.5,27.5 32.85,28.1
GND  (via drill 0.4, 0.4 pad 0.61, 0.9)  (1 unrouted)
  Top 0.2: C9.1 37.55,16.12 37.55,16.2 | 39.7,9.35 39.7,8.94 C13.1 | 10.85,17.52 C15.1 | 11.03,19.2 C17.1 | 20.15,21.85 v20.1,21.8 | 19.23,30.27 v19.2,30.3
  Top 0.254: U4.5 16.3,19.3 v16.4,19.4 | U4.41 20.15,21.85
  Top 0.305: C14.1 1.23,15.43 | 42.05,38.41 D1.A
  Top 0.406: RN1.6 37.95,17.65 | v32.2,22.3 32.2,22.05 U2.3 | 41.5,11.9 R9.2 | 33.52,21.95 C3.1 | v29.25,24.6 R18.2 | v36.38,1.77 36.52,1.93 36.5,1.5
  Top 0.6: C18.1 C17.1 | 37.95,17.65 37.95,17.25 v38,17.2 37.55,16.75 37.55,16.2 | R10.1 R9.2 | 41.5,11.9 v39.25,11.9 38.92,11.57 38.92,10.77 | 39.7,9.35 38.92,10.12 38.92,10.73 | C19.1 10.85,17.52 | 1.2,14.97 C14.1 | 1.23,15.43 1.2,15.4 1.2,15.6 v1.9,16.3 | v12,19.2 11,19.2 11,17.3 | LED2.C LED1.C 27.05,30.7 v27.05,31.9 | v8.3,18.3 8.2,18.5 v4.9,18.5 5.2,18.1 9.1,18.1 | 38.92,10.73 U3.2 38.92,10.77 | 38.92,10.73 38.92,10.77 | R4.1 33.52,21.95 | 32.2,22.05 33.42,22.05 C3.1 | 38.78,41.82 D1.A | v42.05,36.2 42.05,38.41
  Top 0.61: 38.78,41.82 J1.2 | SW1.4 38.65,1.48 37.98,2.1 37.38,1.5 36.5,1.5 SW1.3
  Top 0.8: C19.1 9.45,18.4 | 9.45,18.4 C18.1 | R5.2 35.1,25.8 v34.6,26.3 | v12,19.2 11.03,19.2 | v8.3,18.3 8.3,18.4 9.45,18.4 | C16.1 19.23,30.27 | U5.4 1.2,14.97 | v1.2,10.9 1.2,13 | v34.9,7.75 36.1,7.75
  Top 0.813: v37.75,32 38.95,32 R19.2
  Top 1: C6.2 v33.67,14 | C8.2 v33.67,16.65 | D4.A v36.05,9.25 | 36.08,7.92 D4.A | C12.1 36.5,6.7 36.17,7.03 36.17,7.83 D4.A
  Top 1.422: C6.2 C8.2 | v6.4,28.2 6.4,32.4
  Top 1.93: 36.5,41.9 34.2,41.9 J3.2 | 34.2,36.3 J3.2 | J3.2 34.2,39
  Bottom 1.676: 34.2,41.3 34.2,36.42
  other vias: 40.7,11.9
  pour Bottom (isolate 0.2, no thermals): 30.4,26.7 30.4,32.5 38.15,32.5 39.25,33.65 39.25,36.6 44.1,36.6 44.1,34 44,0.4 31.4,0.4 0.1,0.2 -0.3,0.2 -0.3,43.6 22.8,43.5 26.27,39.92 26.27,35.73 29.8,32.2 29.8,26.4 32.6,23.5 32.6,14.8 33.2,14.8 33.2,23.9
  pour Bottom (no thermals): 35.75,42.65 35.75,40.98 37.45,40.98 37.45,42.65
  pour Top (no thermals): 35.1,40.6 38,40.6 38,43.2 35.1,43.2
  pour Top (isolate 0.2, no thermals): -0.2,6.3 3.1,6.3 3.1,4.8 4.8,3.1 33.4,3.1 33.4,0.5 -0.1,0.5
  pour Bottom (no thermals): 32.8,40.05 35.25,40.05 35.25,37.98 32.85,37.98 31.8,39.02
IOA0  (via drill 0.4)
  Top 0.2: 22.9,28.2 RN7.1
  Top 0.254: U4.20 20.15,15.05 19.8,15.4 19.6,15.4 19.2,15.8 v19.2,15.9
  Top 0.305: v21.7,26.8 21.8,26.8 22.9,27.9 22.9,28.2
  Bottom 0.2: v19.2,15.9 19.2,16.3 20.3,17.4 20.3,19.8 20.8,20.3 20.8,25.9 v21.7,26.8
IOA1  (via drill 0.4)
  Top 0.2: 23.6,28.05 RN7.2
  Top 0.254: U4.21 20.65,15.25 20.2,15.7 20.2,15.8 20.1,15.9 v20.1,16.1
  Top 0.305: v22.2,26.1 23.6,27.5 23.6,28.05
  Bottom 0.2: v20.1,16.1 20.1,16.4 20.7,17 20.7,19.6 21.2,20.1 21.2,25.2 v22.2,26.1
IOA2  (via drill 0.4)
  Top 0.2: RN7.3
  Top 0.254: U4.23 21.65,15.35 v21.1,15.9
  Top 0.305: v22.8,25.5 24.5,27.2 RN7.3
  Bottom 0.2: v21.1,15.9 21.1,19.4 21.6,19.9 21.6,24.4 v22.8,25.5
IOA3  (via drill 0.4)
  Top 0.2: RN7.4
  Top 0.254: U4.24 22.21,15.79 v22,16
  Top 0.305: v24,24.8 25.3,26.1 RN7.4
  Bottom 0.2: v22,16 22,16.3 21.5,16.8 21.5,19.2 22,19.7 22,23.9 22.9,24.8 v24,24.8
IOB0
  Top 0.2: RN8.1 15.28,27.73 16.8,26.2 18.7,26.2 19.6,25.3 19.6,23.02 U4.42
IOB1
  Top 0.2: RN8.2 16.07,27.62 17.1,26.6 19,26.6 20.65,24.95 U4.40
IOB2
  Top 0.2: RN8.3 16.88,27.62 17.5,27 19.3,27 22,24.3 22.8,24.3 23.3,23.8 24.6,23.8 25.2,23.2 25.2,21.1 24.9,20.8 U4.35
IOB3
  Top 0.2: RN8.4 17.68,28.02 17.7,27.8 18,27.5 19.5,27.5 22.3,24.7 23,24.7 23.5,24.2 24.9,24.2 25.6,23.5 25.6,20.8 25.1,20.3 U4.34
IOC0/XIO4  (via drill 0.4)
  Top 0.2: U4.47 17.15,23.85 16.4,24.6 15.6,24.6 14.2,26 v8.1,26 7.92,26.18 RN9.1
  Top 0.305: RN2.4 7,10 6.9,10.1 v6.9,10.3
  Bottom 0.2: v6.9,10.3 6.9,12.6 7.3,13 7.3,13.6 6.7,14.2 6.7,20.86 7.7,21.86 7.7,25.6 v8.1,26
IOC1
  Top 0.2: U4.46 17.65,23.95 16.6,25 15.9,25 14.5,26.4 9.3,26.4 8.72,26.98 RN9.2
IOC2
  Top 0.2: U4.45 18.15,24.15 16.9,25.4 16.2,25.4 14.8,26.8 9.9,26.8 9.52,27.18 RN9.3
IOC3/PWM  (via drill 0.4)
  Top 0.2: U4.43 19.15,25.05 18.4,25.8 16.5,25.8 15.1,27.2 11.9,27.2 v11.5,27.6 10.96,28.14 RN9.4 | v10.7,15.7 10.7,15.3 8.2,12.8 v8.2,12.9
  Top 0.305: v7.8,10.4 RN2.3
  Bottom 0.2: v11.5,27.6 10.7,26.8 v10.7,15.7 | v8.2,12.9 7.8,12.5 v7.8,10.4
IOD0/XIO10  (via drill 0.4)
  Top 0.2: U4.12 14.9,15.66 14.9,12.9 12,10 RN3.4 11.9,9.4 | v5.6,23.2 5.4,23.4 5.4,24.2 3.5,26.1 1.9,26.1 1.14,26.86 RN10.1
  Top 0.305: v11.1,9.4 11.9,9.4
  Bottom 0.2: v5.6,23.2 5.5,23.1 5.5,12.6 5.7,12.4 5.7,9.8 6.4,9.1 10.8,9.1 v11.1,9.4
IOD1/XIO7  (via drill 0.4)
  Top 0.2: U4.11 14.1,16.3 13.9,16.1 13.9,12.6 11.65,10.35 10.75,10.35 v10.4,10 9.7,9.3 RN2.1 | RN10.2 1.94,26.96 2.3,26.6 3.7,26.6 6.6,23.7 v6.7,23.7
  Bottom 0.2: v6.7,23.7 6.7,23.3 5.9,22.5 5.9,12.9 6.1,12.7 6.1,10 6.5,9.6 10,9.6 v10.4,10
IOD2
  Top 0.2: U4.1 14.44,21.36 14.38,21.43 14.18,21.43 13.7,21.9 13.7,23.4 14.2,23.9 14.2,24.6 13.6,25.2 13,25.2 12.7,24.9 6.1,24.9 3.9,27.1 3,27.1 2.74,27.36 RN10.3
IOD3
  Top 0.2: U4.48 16.52,23.77 16.1,24.2 15.3,24.2 13.9,25.6 12.7,25.6 12.4,25.3 6.4,25.3 3.56,28.14 RN10.4
LX
  Top 0.2: C11.1 37.38,7.22 37.1,7.5 37.1,11.7 36.3,11.7 36.1,11.7 D4.C
  Top 0.6: U3.6 37.95,12.4 37.55,12 36.8,12 36.3,11.7
  Top 1.422: L1.P$1 D4.C
N$1
  Top 0.2: D2.1 43.15,23.25 43.75,23.85 43.75,29.85 43.55,30.05 43.3,30.05 D3.1 42.65,30.45 | 36.7,31.1 U1.8
  Top 0.305: 42.65,30.45 41.85,31.25 41.85,31.95 41.45,32.35 40.6,32.35 39.85,33.1 37.65,33.1 36.75,32.2 U1.8
  Top 0.406: 36.7,31.1 36.7,29.75
  Top 0.6: U1.7 U1.8
N$2
  Top 0.2: 37.05,21.95 C1.2
  Top 0.406: RN1.4 37.15,20.7 37.05,20.8 37.05,21.95
N$3
  Top 0.254: X1.1 7.42,15.8 | 9.3,15.8 9.32,15.78 C19.2 10,16.3 10.1,16.4 11.8,16.4 11.9,16.5 11.9,18.1 12.1,18.3 U4.7
  Top 0.406: 7.42,15.8 9.3,15.8
N$4
  Top 0.2: 9.8,20.45 9.5,20.88 C18.2 9.43,20.93 9.4,20.9 | X1.2 7.53,20.9
  Top 0.254: U4.6 13.5,18.8 12.25,20.05 10.2,20.05 9.8,20.45
  Top 0.406: 7.53,20.9 9.4,20.9
N$5
  Top 0.305: J6.7 19.27,34.92 20.5,33.7 22.3,33.7 22.9,33.1 RN7.8
N$6
  Top 0.2: R5.1 33.5,25.15
  Top 0.305: 33.5,25.15 R7.2
  Top 0.8: U1.4 32.6,27.2 33.3,26.5 33.3,25.3 R5.1
N$7
  Top 0.6: R7.1 C7.1
N$8
  Top 0.2: T1.3 42.3,19.65 | 41.85,21.45 R1.1 41.25,22 41.25,24.4 42,25.15 D2.2 | 41.85,20.2 41.85,20.45 L2.1
  Top 0.5: 42.3,19.65 41.8,20.25 41.85,20.45 41.85,21.45 | RN1.1 39.55,20.2 41.85,20.2
N$9
  Top 0.2: LED1.A 27.2,28.5 28.5,27.2 R15.1
N$10
  Top 0.305: J6.5 19.23,37.47 20.5,36.2 22.3,36.2 23.7,34.8 RN7.7
N$11
  Top 0.305: J6.3 19.2,40.01 20.4,38.8 22.2,38.8 24.5,36.5 RN7.6
N$12
  Top 0.2: RN1.3 37.95,20.85 37.6,21.2 37.6,23.6 | 37.6,23.6 37.6,27.2 U1.5 36.84,27.2 | C5.1 37.6,23.6
  Top 0.406: T2.C 38.7,27.7 38.2,27.2 36.84,27.2
N$13
  Top 0.305: J6.1 19.25,42.55 20.5,41.3 22.2,41.3 25.3,38.2 RN7.5
N$14
  Top 0.305: RN1.5 37.2,18.7 | R3.1 28.66,21.05 U2.2 U2.1
  Top 0.406: 33.52,20.25 C3.2 33.17,20.23 33,20.4 U2.1
  Top 0.5: RN1.5 37.15,18.65 36.4,19.4 35.95,19.4 R4.2
  Top 0.6: R4.2 33.52,20.25
  Top 0.61: D5.A 35.1,18.73 R4.2
N$15
  Top 0.2: 36.73,25.38 R6.2
  Top 0.6: C5.2 36.73,25.38
N$16
  Top 0.305: J7.5 11.54,37.47 12.8,36.2 14.6,36.2 16.1,34.7 16.1,30.16 RN8.7
N$17
  Top 0.305: J7.3 11.7,40.01 13,38.7 14.6,38.7 16.9,36.4 16.9,30.16 RN8.6
N$19
  Top 0.6: U3.1 37.95,9.03 C11.2
N$20
  Top 0.2: 39.93,12.98 40.1,13.05 | R8.2 43.15,14 43.15,13.7 43.05,13.6 42.62,13.6 42.62,14.45
  Top 0.254: 43.35,14 R8.2
  Top 0.305: 40.1,13.05 43.3,13.05 | U3.4 39.93,12.98
  Top 0.6: R8.2 43.3,13.05 R9.1
N$22
  Top 0.305: J7.7 11.47,34.92 12.7,33.7 14.6,33.7 15.3,33 15.3,30.16 RN8.8
N$23
  Top 0.305: J7.1 11.86,42.55 13.1,41.3 14.6,41.3 17.7,38.2 17.7,30.16 RN8.5
N$24
  Top 0.2: R11.1 43.33,8.68
  Top 0.305: 43.3,9.6 40.85,9.6 39.85,10.6 U3.3
  Top 0.6: R10.2 43.3,9.6 R11.1 | 43.33,8.68 C10.1
N$25
  Top 0.406: R17.2 41.35,2.15 42.62,3.42 42.62,4.65 LED3.C
N$28
  Top 0.406: RN1.7 38.75,17.5 38.9,17.35 39.5,17.35 39.55,17.4 RN1.8
  Top 0.5: RN1.8 39.55,17.55 | 39.55,17.55 39.55,17.12 38.95,16.5 38.9,16.45 C2.2 | T1.1 39.6,17.6 39.55,17.55
N$29
  Top 0.305: J8.3 6.38,37.52 8.7,35.2 8.7,30.16 RN9.7
N$30
  Top 0.305: J8.2 7.09,40.01 9.5,37.6 9.5,30.16 RN9.6
N$31
  Top 0.305: J8.4 6.97,34.92 7.9,34 7.9,30.16 RN9.8
N$32
  Top 0.305: RN10.8 1.14,38.84 3.8,41.5 3.8,42.5 J9.1
N$33
  Top 0.305: RN10.7 1.94,38.44 3.5,40 J9.2
N$34
  Top 0.305: RN10.6 2.74,36.36 J9.3
N$35
  Top 0.305: RN10.5 3.54,30.44 5.1,32 5.1,33.67 J9.4
N$36
  Top 0.305: J8.1 6.46,41.95 10.1,38.3 10.1,31.7 10.3,31.5 10.3,30.16 RN9.5
N$37
  Top 0.2: LED2.A 28.9,28.7 29.95,27.65 29.95,26.7 30.4,26.25 31.2,26.25 31.55,25.9 31.6,25.05 R16.1
N$38
  Top 0.305: RN2.6 7.8,6.2 8.3,5.7 8.3,4.6 7.5,3.8 5.9,3.8 J5.3
N$39
  Top 0.2: D3.3 40.7,30.55 41.7,29.55 43.15,29.55 43.35,29.35 43.35,27.45 42.95,27.05 T2.B
N$41
  Top 0.305: RN2.8 9.4,6.9 10.8,5.5 10.8,3.65 J5.7
N$42
  Top 0.305: RN3.6 12.8,6 13.3,5.5 13.3,3.61 J5.9
N$43
  Top 0.305: RN3.8 14.4,7 15.8,5.6 15.8,3.57 J5.11
N$44
  Top 0.305: RN4.6 17.8,6.1 18.4,5.5 18.4,3.63 J5.13
N$45
  Top 0.305: RN2.5 7,6.7 6.2,5.9 5.43,5.9 J5.4
N$46  (via drill 0.4)
  Top 0.2: 43.27,18.73 43.3,18.7
  Top 0.305: T2.E 38.98,28.65 v38.92,28.6 | v38.67,26.38 38.67,25.57 R6.1 | L2.2 40.26,15.88 40.9,16.52 43.3,16.52 | 43.3,16.52 R2.1 | 43.3,16.52 T1.2 43.3,18.7 R1.2 | RN1.2 38.75,19.57 39,19.32 40.25,19.32 v40.55,19.02 40.85,18.73 43.27,18.73
  Bottom 0.254: v38.67,26.38 38.65,20.93 v40.55,19.02
  Bottom 0.305: v38.92,28.6 38.92,26.62 v38.67,26.38
N$47
  Top 0.2: 9.4,5.19 J5.8
  Top 0.305: RN2.7 8.6,6.4 9.4,5.6 9.4,5.19
N$48
  Top 0.305: RN3.5 12,5.25 J5.10
N$49
  Top 0.305: RN3.7 13.6,6.4 14.6,5.4 J5.12
N$50
  Top 0.305: RN4.5 17,5.17 J5.14
N$58
  Top 0.305: RN4.8 19.4,7.1 20.9,5.6 20.9,3.59 J5.15
N$59
  Top 0.305: RN5.6 22.8,6.1 23.5,5.4 23.5,3.65 J5.17
N$60
  Top 0.305: RN4.7 18.6,6.4 19.6,5.4 J5.16
N$61
  Top 0.305: RN5.5 22,5.29 J5.18
N$63
  Top 0.305: RN5.8 24.4,7 26,5.4 26,3.61 J5.19
N$64
  Top 0.305: RN5.7 23.6,6.49 24.79,5.29 24.79,5.1 J5.20
N$65
  Top 0.305: RN6.5 26.6,5.81 J5.22
N$66
  Top 0.305: RN6.6 27.4,6.5 28.7,5.2 28.7,3.83 J5.23
N$67
  Top 0.305: RN6.7 28.2,6.7 29.6,5.3 J5.24
N$68
  Top 0.2: RN6.8 29,6.9
  Top 0.305: 29,6.9 29.6,6.3 30.2,6.3 31.2,5.3 31.2,3.67 J5.25
N$69
  Top 0.305: J5.26 32.54,5.26 R14.1
RESET  (via drill 0.4 pad 0.61)
  Top 0.2: U4.3 13.95,20.3 13.35,20.9 11.6,20.9 11.57,20.93 C17.2 11,21.6 10.8,21.8 9.9,21.8 | 9.9,21.8 5,21.8 v4.8,21.6 | R12.1 9.9,21.8
  Bottom 0.2: v4.8,21.6 4.81,21.5 J4.10
RXD  (via drill 0.4)
  Top 0.2: 23.3,14.5 v23.2,14.8 | 22.29,22.9 U4.37
  Top 0.254: v23.3,12.1 23.3,14.5 | v23.2,22.9 22.29,22.9
  Top 0.305: RN5.4 22,10.1 21.8,10.3 v21.6,10.3
  Bottom 0.2: 23.3,12 v23.3,12.1 | v23.2,14.8 23.2,15.2 23.7,15.7 23.7,22.4 v23.2,22.9
  Bottom 0.254: v21.6,10.3 23.3,12
SCL
  Top 0.2: U4.15 17.65,12.15 16.2,10.7 14.2,10.7 13.6,10.1 RN3.2
SDA
  Top 0.2: U4.16 18.15,11.95 16.4,10.2 14.6,10.2 14.4,10 RN3.1
SPI_MISO  (via drill 0.4)
  Top 0.2: U4.27 25,16.8 25.6,16.2 v25.6,11.6
  Top 0.305: RN4.2 18.6,10.2 18.9,10.5 20.4,10.5 20.8,10.1 v20.8,9.6
  Bottom 0.2: v20.8,9.6 20.9,9.5 23.1,9.5 23.6,10 23.6,10.3 24.9,11.6 v25.6,11.6
SPI_MOSI
  Top 0.2: U4.28 25.3,17.3 26.4,16.2 26.4,10.8 26,10.4 26,8.9 25.4,8.3 20.1,8.3 19.4,9 RN4.1
SPI_SCK  (via drill 0.4)
  Top 0.254: U4.22 21.15,12.85 v21,12.7
  Top 0.305: v17.8,10.5 RN4.3
  Bottom 0.2: v21,12.7 20.6,12.7 18.4,10.5 v17.8,10.5
SPI_SSEL  (via drill 0.4)
  Top 0.2: v15.6,11.9 15.6,14.7 16.2,15.3 16.2,16.6 16,16.8 U4.10
  Top 0.305: RN4.4 15.8,9.3 v15.6,9.5
  Bottom 0.2: v15.6,9.5 v15.6,11.9
SWCLK  (via drill 0.4)
  Top 0.2: U4.29 23,17.8 22.5,18.3 21.9,18.3 21.3,17.7 v17.2,17.7 | v8.8,14.6 8.5,14.9 5.4,14.9 4.3,16 4.3,18.2 4.2,18.3 4.2,23 3.48,23.72 J4.4
  Bottom 0.2: v17.2,17.7 17.2,17.1 14.8,14.7 13.1,14.7 11.8,13.4 10,13.4 v8.8,14.6
SWDIO  (via drill 0.4)
  Top 0.2: U4.39 21.15,21.95 20.3,21.1 17,21.1 v15.5,22.6 | v13.4,24.4 13.2,24.2 8.9,24.2 7.72,23.02 6.55,23.02 5.92,22.4 5.2,22.4 4.8,22.8 4.8,23.8 3.5,25.1 3.23,25.1 J4.2
  Bottom 0.2: v15.5,22.6 15.2,22.6 v13.4,24.4
TXD  (via drill 0.4)
  Top 0.2: 24.3,14.7 v24.2,14.8 | 24.5,21.34 U4.36
  Top 0.254: v24.3,12.1 24.3,14.7 | v24.5,22.1 24.5,21.34
  Top 0.305: RN5.3 v22.8,10.2
  Bottom 0.2: v22.8,10.2 22.8,10.3 | 24.3,11.8 v24.3,12.1 | v24.2,14.8 24.2,21.8 v24.5,22.1
  Bottom 0.254: 22.8,10.3 24.3,11.8
VCC  (via drill 0.4, 0.4 pad 0.61)  (1 unrouted)
  Top 0.2: 41.58,8.68 R11.2 | 39.74,7.05 C13.2 | v18.4,20.3 18.4,20.2 | v18.5,24.7 18.6,24.6 | 12.25,22.75 v12.5,22.8 | 2.98,17.38 R13.2 | 20.12,28.9 C16.2 20.73,28.52 20.3,28.9
  Top 0.254: C15.2 13.28,17.8 U4.8 16,17.8 | v18.5,21.7 18.65,22.05 U4.44 18.65,24.55 v18.5,24.7 | 5,7 U5.8
  Top 0.305: R12.2 12.25,22.75
  Top 0.406: 16.4,18.2 16,17.8 | 2.8,15 2.88,15.07 C14.2 | U2.5 30.43,19.7 | LED3.A 41.12,7.04 C13.2
  Top 0.6: 41.58,8.68 C10.2 39.74,7.05 | C13.2 39.71,6.91 37.95,5.2 34.95,5.2 34.7,5.45 34.7,6.12 | U5.7 U5.8 | v5.8,6.7 5.3,6.7 5,7 5,9 v4.4,9.7 | 18.4,20.2 16.4,18.2 | 2.8,15 2.46,14.69 U5.3 2.46,11.46 v2.5,11.4 | C14.2 2.98,17.38
  Top 0.61: D5.C 30.6,18.7
  Top 0.8: R3.2 28.07,19.75
  Top 1: 28.07,19.75 27.2,20.6 v27.2,24.8 | v18.6,28.9 20.12,28.9 | 20.3,28.9 v21.7,28.9 21.7,32.21 J6.10 | R3.2 28.52,19.68 28.52,19.7 30.43,19.7 30.52,19.48 30.6,19.45 30.6,18.7 30.6,11.1 32.7,9 33.2,9 L1.P$2 33.25,7.67 C12.2
  Bottom 0.2: J5.5 6.94,2.46 | v12.5,22.8 12.5,22.9 12.3,23.1 12.3,25.2 13.8,26.7 18.5,26.7
  Bottom 0.6: 6.94,2.46 5.8,3.6 v5.8,6.7
  Bottom 0.8: v18.5,21.7 18.4,21.6 v18.4,20.3 | 18.5,28.7 v18.6,28.9 18.1,29.3 4.6,29.3 2.05,26.75 J4.1 1.39,25.09 0.9,24.5 0.9,13 v2.5,11.4 4.2,9.7 v4.4,9.7 | J7.10 13.98,32.38 15.2,33.6 20.41,33.6 J6.10
  Bottom 1: v27.2,24.8 23.1,28.9 v21.7,28.9 | 18.5,28.7 18.5,26.7 v18.5,24.7 v18.5,21.7
  pour Top (isolate 0.2, no thermals): 15.9,17.7 15.8,17.8 15.9,17.9 15.9,21.6 16.4,22.1 18.5,22.1 18.6,22.2 18.7,22.2 18.8,22.1 19.2,22 22.2,22 22.9,21.3 22.9,15.2 22.8,15.1 16.1,15.1 15.9,15.3
XIO8/ISP_EN  (via drill 0.4)  (1 unrouted)
  Top 0.2: v11.3,14.9 9.1,12.7 v9.1,12.3 8.9,12.1 7.7,12.1 7.4,12.4 7.4,13.8 6.7,14.5 5.2,14.5 3.9,15.8 3.9,18 3.5,18.4 1.6,18.4 1.05,17.85 R13.1 1.1,17.4
  Top 0.254: U4.4 13.8,19.8 13.4,20.2 v13.1,20.2 | 1.1,17.4 1.1,20.7 1.7,21.3 2.03,21.3
  Top 0.305: RN2.2 8.6,10.1 v8.7,10.3
  Bottom 0.2: v8.7,10.3 8.7,12 9,12.3 v9.1,12.3 | v11.3,14.9 11.3,17.5 13.1,19.3 v13.1,20.2
XIO9
  Top 0.2: U4.14 17.15,12.35 16,11.2 13.9,11.2 12.8,10.1 RN3.3
XIO19
  Top 0.2: U4.19 19.65,12.75 21,11.4 23.2,11.4 24.4,10.2 RN5.1
XIO20
  Top 0.2: U4.18 19.15,12.55 20.7,11 22.9,11 23.6,10.3 RN5.2
XIO22
  Top 0.2: RN6.4 26.6,10.2 26.8,10.4 26.8,16.6 25.1,18.3 U4.30
XIO23  (via drill 0.9)
  Top 0.2: U4.31 25.4,18.8 27.2,17 27.2,10.4 27.4,10.2 RN6.3 27.4,8.65 27.7,8.35 29.55,8.35 29.75,8.15 31.25,8.15 31.7,7.7 31.7,7.4 33.6,5.5 33.6,4.3 34.4,3.5 SW1.1
  Top 0.406: SW1.2 40.8,3.5 R17.1
  Top 0.5: v37.55,3.95 37.2,3.5
  Top 0.6: SW1.1 37.2,3.5 37.48,3.5 37.98,3 38.48,3.5 SW1.2
XIO24
  Top 0.2: U4.32 25.7,19.3 27.6,17.4 27.6,10.8 28.2,10.2 RN6.2
XIO25
  Top 0.2: U4.33 25.9,19.8 | 25.9,19.8 28,17.7 28,11.2 29,10.2 RN6.1 | R15.2 26.85,26.75 26,25.9 26,19.9 25.9,19.8
XIO26  (via drill 0.4)
  Top 0.2: U4.25 24.76,15.74 24.9,15.6 24.9,10.6 25.4,10.1 v25.4,10 | 30.6,9.4 R14.2 | 30,25 R16.2 29.5,26.1 27,26.1 26.4,25.5 26.4,20 28.4,18 28.4,11.8 v29.9,10.3
  Top 0.305: v29.9,10.3 30.6,9.6 30.6,9.4
  Bottom 0.2: v25.4,10 29.6,10 v29.9,10.3

### Text on the board
Top: B | A | C | D
Bottom: GNAX V2.0